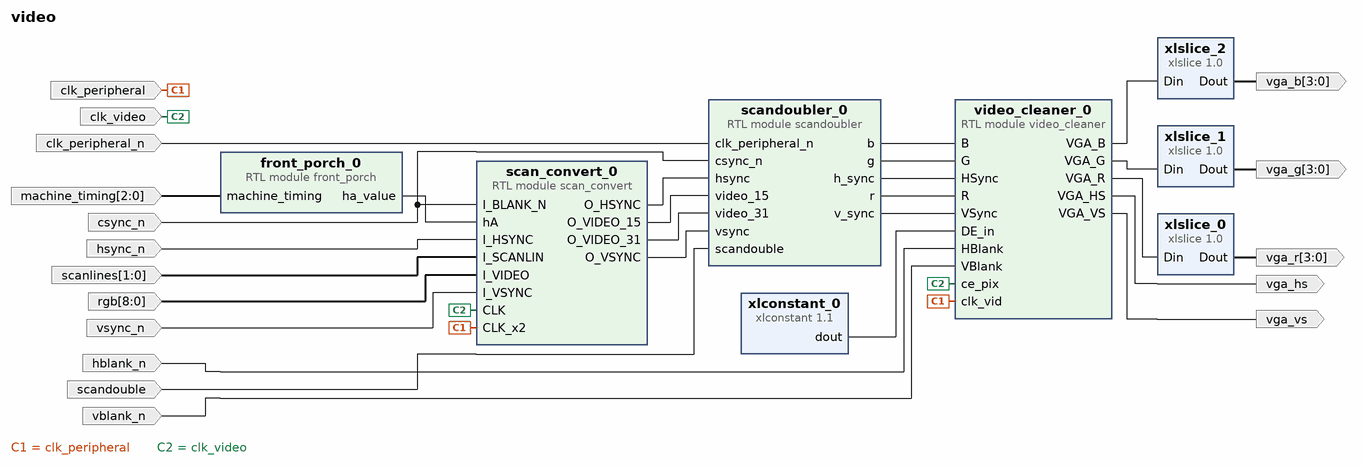
[diagram p0: block diagram of the top level]
# Vivado block design video, xc7a100tcsg324-1, Vivado 2021.2
create_bd_design video

create_bd_port -dir I -type clk clk_video
set_property -dict {CONFIG.FREQ_HZ 14000000} [get_bd_ports clk_video]
create_bd_port -dir I -type clk clk_peripheral
set_property -dict {CONFIG.FREQ_HZ 28000000} [get_bd_ports clk_peripheral]
create_bd_port -dir I -from 8 -to 0 rgb
create_bd_port -dir I hsync_n
create_bd_port -dir I vsync_n
create_bd_port -dir I csync_n
create_bd_port -dir I -from 1 -to 0 scanlines
create_bd_port -dir I -from 2 -to 0 machine_timing
create_bd_port -dir I scandouble
create_bd_port -dir I -type clk clk_peripheral_n
set_property -dict {CONFIG.FREQ_HZ 28000000} [get_bd_ports clk_peripheral_n]
create_bd_port -dir I hblank_n
create_bd_port -dir I vblank_n
create_bd_port -dir O vga_vs
create_bd_port -dir O vga_hs
create_bd_port -dir O -from 3 -to 0 vga_r
create_bd_port -dir O -from 3 -to 0 vga_g
create_bd_port -dir O -from 3 -to 0 vga_b

create_bd_cell -type module -reference scan_convert scan_convert_0
create_bd_cell -type module -reference front_porch front_porch_0
create_bd_cell -type module -reference video_cleaner video_cleaner_0
create_bd_cell -type module -reference scandoubler scandoubler_0
create_bd_cell -type ip -vlnv xilinx.com:ip:xlconstant:1.1 xlconstant_0
set_property -dict {CONFIG.CONST_VAL 0} [get_bd_cells xlconstant_0]
create_bd_cell -type ip -vlnv xilinx.com:ip:xlslice:1.0 xlslice_0
set_property -dict {CONFIG.DIN_FROM 7 CONFIG.DIN_TO 4 CONFIG.DIN_WIDTH 8 CONFIG.DOUT_WIDTH 4} [get_bd_cells xlslice_0]
create_bd_cell -type ip -vlnv xilinx.com:ip:xlslice:1.0 xlslice_1
set_property -dict {CONFIG.DIN_FROM 7 CONFIG.DIN_TO 4 CONFIG.DIN_WIDTH 8 CONFIG.DOUT_WIDTH 4} [get_bd_cells xlslice_1]
create_bd_cell -type ip -vlnv xilinx.com:ip:xlslice:1.0 xlslice_2
set_property -dict {CONFIG.DIN_FROM 7 CONFIG.DIN_TO 4 CONFIG.DIN_WIDTH 8 CONFIG.DOUT_WIDTH 4} [get_bd_cells xlslice_2]

# ---- connections ----

connect_bd_net [get_bd_ports clk_peripheral] [get_bd_pins scan_convert_0/CLK_x2] [get_bd_pins video_cleaner_0/clk_vid]
connect_bd_net [get_bd_ports clk_peripheral_n] [get_bd_pins scandoubler_0/clk_peripheral_n]
connect_bd_net [get_bd_ports clk_video] [get_bd_pins scan_convert_0/CLK] [get_bd_pins video_cleaner_0/ce_pix]
connect_bd_net [get_bd_ports csync_n] [get_bd_pins scan_convert_0/I_BLANK_N] [get_bd_pins scandoubler_0/csync_n]
connect_bd_net [get_bd_pins front_porch_0/ha_value] [get_bd_pins scan_convert_0/hA]
connect_bd_net -net hblank_1 [get_bd_ports hblank_n] [get_bd_pins video_cleaner_0/HBlank]
connect_bd_net [get_bd_ports hsync_n] [get_bd_pins scan_convert_0/I_HSYNC]
connect_bd_net [get_bd_ports machine_timing] [get_bd_pins front_porch_0/machine_timing]
connect_bd_net [get_bd_pins scan_convert_0/O_HSYNC] [get_bd_pins scandoubler_0/hsync]
connect_bd_net [get_bd_pins scan_convert_0/O_VIDEO_15] [get_bd_pins scandoubler_0/video_15]
connect_bd_net [get_bd_pins scan_convert_0/O_VIDEO_31] [get_bd_pins scandoubler_0/video_31]
connect_bd_net [get_bd_pins scan_convert_0/O_VSYNC] [get_bd_pins scandoubler_0/vsync]
connect_bd_net [get_bd_ports scandouble] [get_bd_pins scandoubler_0/scandouble]
connect_bd_net [get_bd_pins scandoubler_0/b] [get_bd_pins video_cleaner_0/B]
connect_bd_net [get_bd_pins scandoubler_0/g] [get_bd_pins video_cleaner_0/G]
connect_bd_net [get_bd_pins scandoubler_0/h_sync] [get_bd_pins video_cleaner_0/HSync]
connect_bd_net [get_bd_pins scandoubler_0/r] [get_bd_pins video_cleaner_0/R]
connect_bd_net [get_bd_pins scandoubler_0/v_sync] [get_bd_pins video_cleaner_0/VSync]
connect_bd_net [get_bd_ports scanlines] [get_bd_pins scan_convert_0/I_SCANLIN]
connect_bd_net [get_bd_ports vblank_n] [get_bd_pins video_cleaner_0/VBlank]
connect_bd_net -net video_1 [get_bd_ports rgb] [get_bd_pins scan_convert_0/I_VIDEO]
connect_bd_net [get_bd_pins video_cleaner_0/VGA_B] [get_bd_pins xlslice_2/Din]
connect_bd_net [get_bd_pins video_cleaner_0/VGA_G] [get_bd_pins xlslice_1/Din]
connect_bd_net [get_bd_pins video_cleaner_0/VGA_HS] [get_bd_ports vga_hs]
connect_bd_net [get_bd_pins video_cleaner_0/VGA_R] [get_bd_pins xlslice_0/Din]
connect_bd_net [get_bd_pins video_cleaner_0/VGA_VS] [get_bd_ports vga_vs]
connect_bd_net [get_bd_ports vsync_n] [get_bd_pins scan_convert_0/I_VSYNC]
connect_bd_net [get_bd_pins xlconstant_0/dout] [get_bd_pins video_cleaner_0/DE_in]
connect_bd_net [get_bd_pins xlslice_0/Dout] [get_bd_ports vga_r]
connect_bd_net [get_bd_pins xlslice_1/Dout] [get_bd_ports vga_g]
connect_bd_net [get_bd_pins xlslice_2/Dout] [get_bd_ports vga_b]

validate_bd_design
save_bd_design
